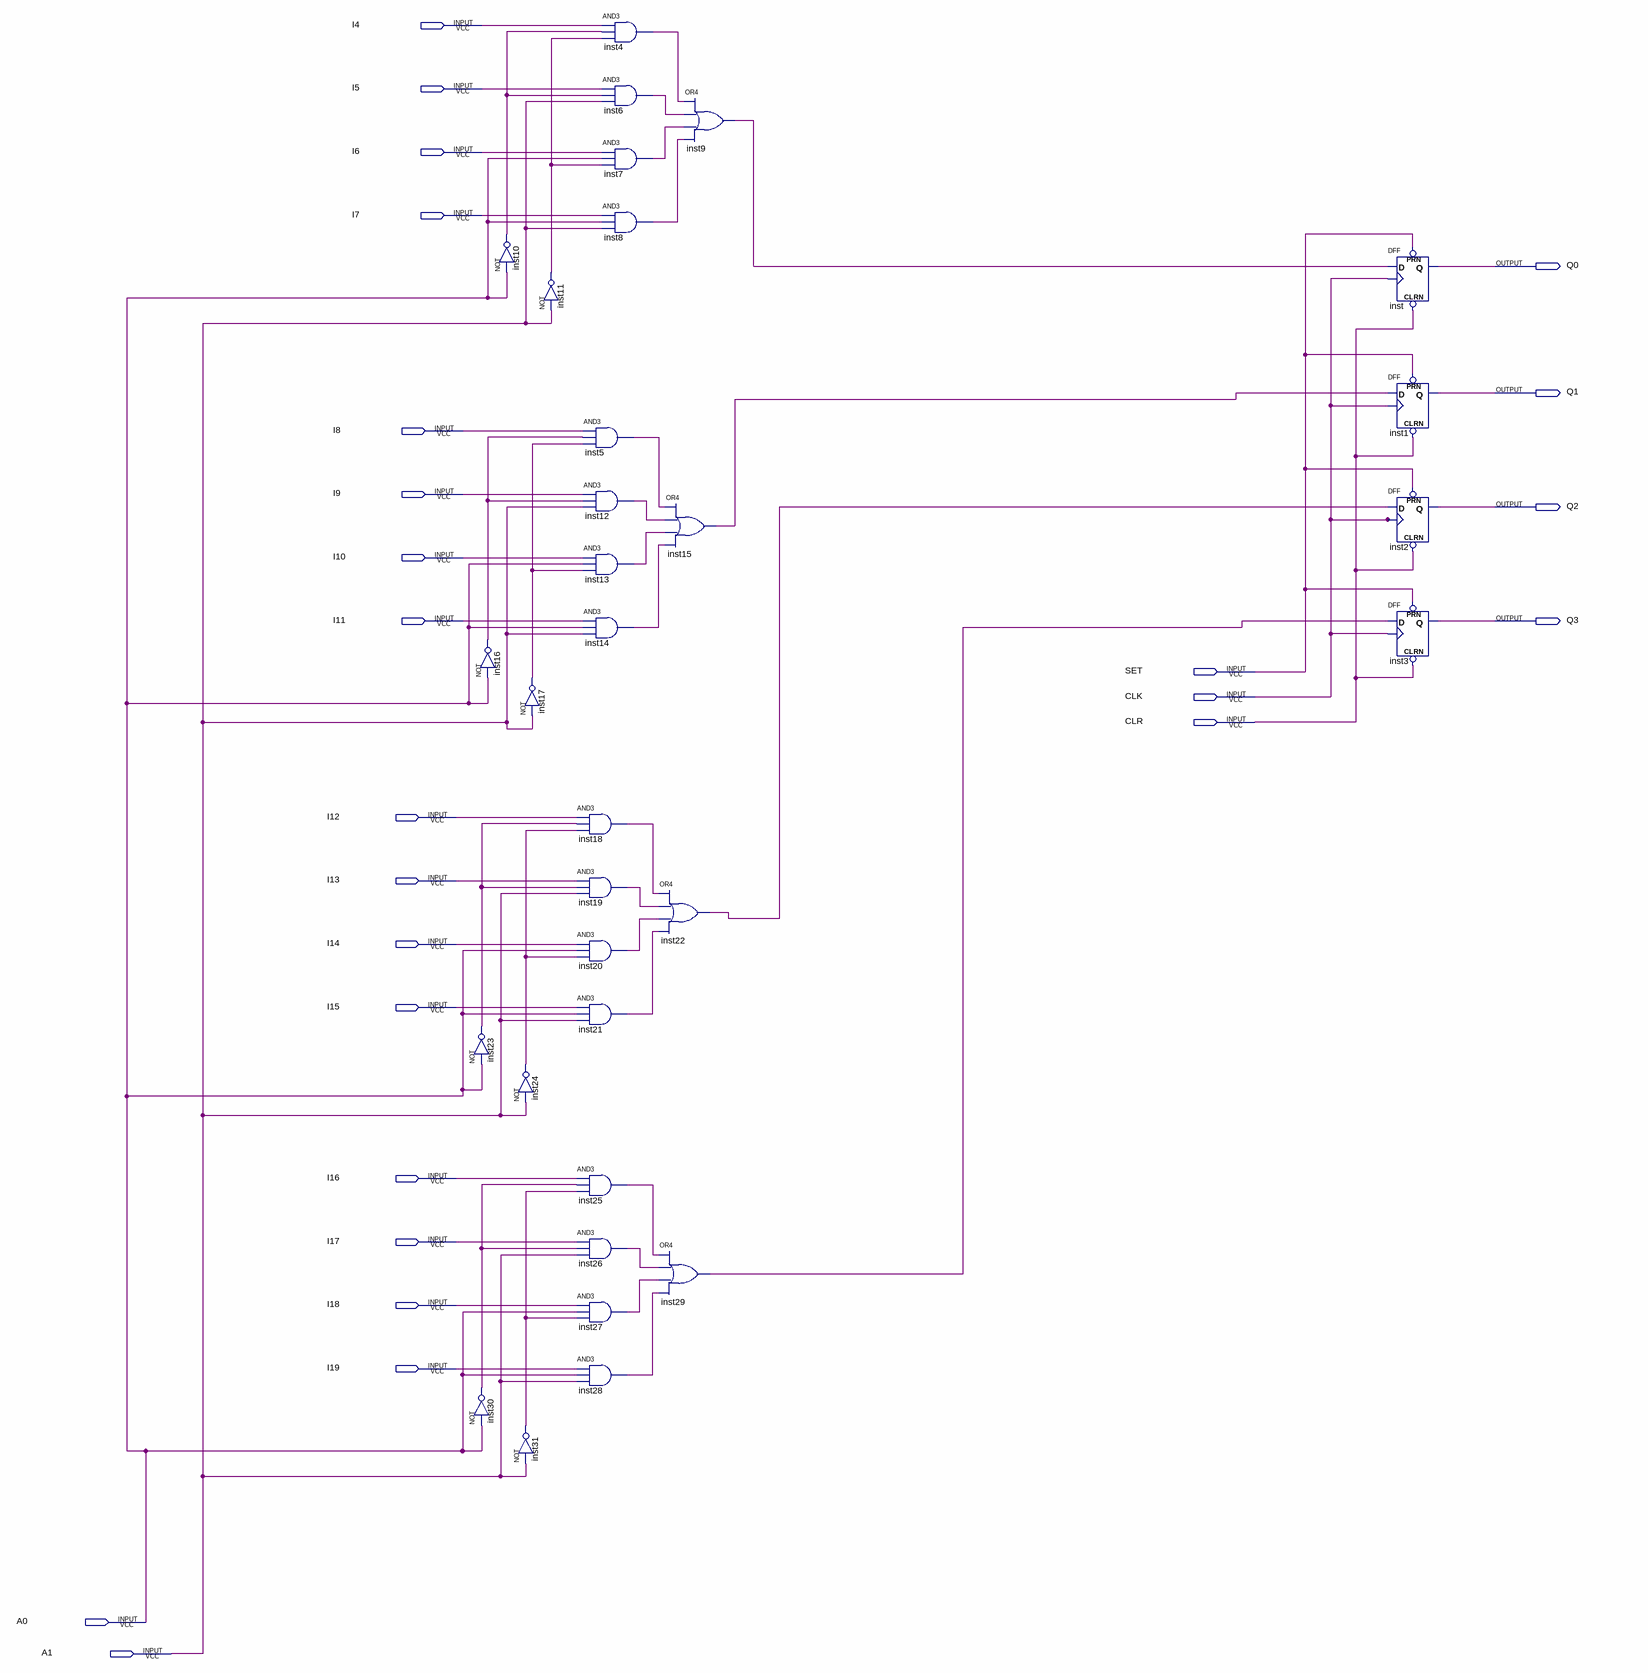
[diagram p0: schematic sheet]
// Quartus schematic ea01m02e03.bdf as structural Verilog: 32 symbols, 25 pins
module ea01m02e03 (
  input  I4,
  input  I5,
  input  I6,
  input  I7,
  input  I8,
  input  I9,
  input  I10,
  input  I11,
  input  SET,
  input  CLK,
  input  CLR,
  input  I12,
  input  I13,
  input  I14,
  input  I15,
  input  I16,
  input  I17,
  input  I18,
  input  I19,
  input  A0,
  input  A1,
  output Q0,
  output Q1,
  output Q2,
  output Q3
);

  wire inst4_out, inst5_out, inst6_out, inst7_out, inst8_out, inst9_out, inst10_out, inst11_out, inst12_out,
       inst13_out, inst14_out, inst15_out, inst16_out, inst17_out, inst18_out, inst19_out, inst20_out,
       inst21_out, inst22_out, inst23_out, inst24_out, inst25_out, inst26_out, inst27_out, inst28_out,
       inst29_out, inst30_out, inst31_out;

  not inst16 (inst16_out, A0);
  not inst23 (inst23_out, A0);
  not inst30 (inst30_out, A0);
  not inst10 (inst10_out, A0);
  not inst17 (inst17_out, A1);
  not inst24 (inst24_out, A1);
  not inst31 (inst31_out, A1);
  not inst11 (inst11_out, A1);
  and inst18 (inst18_out, I12, inst23_out, inst24_out);
  and inst19 (inst19_out, I13, inst23_out, A1);
  and inst20 (inst20_out, I14, A0, inst24_out);
  and inst21 (inst21_out, I15, A0, A1);
  and inst25 (inst25_out, I16, inst30_out, inst31_out);
  and inst26 (inst26_out, I17, inst30_out, A1);
  and inst27 (inst27_out, I18, A0, inst31_out);
  and inst28 (inst28_out, I19, A0, A1);
  and inst4 (inst4_out, I4, inst10_out, inst11_out);
  and inst6 (inst6_out, I5, inst10_out, A1);
  and inst7 (inst7_out, I6, A0, inst11_out);
  and inst8 (inst8_out, I7, A0, A1);
  and inst5 (inst5_out, I8, inst16_out, inst17_out);
  and inst12 (inst12_out, I9, inst16_out, A1);
  and inst13 (inst13_out, I10, A0, inst17_out);
  and inst14 (inst14_out, I11, A0, A1);
  or inst15 (inst15_out, inst5_out, inst12_out, inst13_out, inst14_out);
  or inst22 (inst22_out, inst18_out, inst19_out, inst20_out, inst21_out);
  or inst29 (inst29_out, inst25_out, inst26_out, inst27_out, inst28_out);
  or inst9 (inst9_out, inst4_out, inst6_out, inst7_out, inst8_out);
  DFF inst (.CLRN(CLR), .CLK(CLK), .D(inst9_out), .PRN(SET), .Q(Q0));
  DFF inst1 (.CLRN(CLR), .CLK(CLK), .D(inst15_out), .PRN(SET), .Q(Q1));
  DFF inst2 (.CLRN(CLR), .CLK(CLK), .D(inst22_out), .PRN(SET), .Q(Q2));
  DFF inst3 (.CLRN(CLR), .CLK(CLK), .D(inst29_out), .PRN(SET), .Q(Q3));
endmodule
